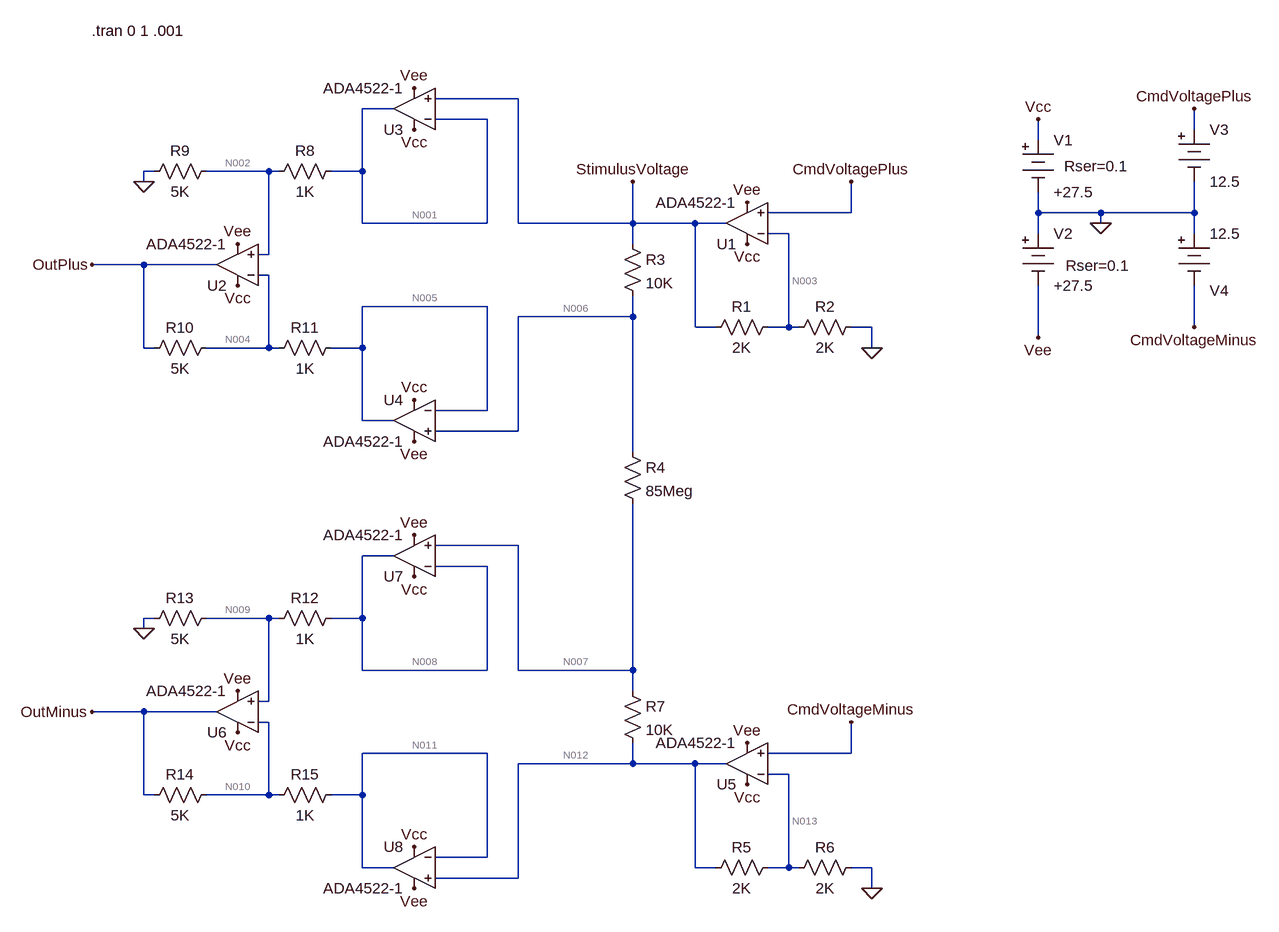
[diagram p0: schematic JukkaRev2_Model2D(012220).asc]
JukkaRev2_Model2D(012220).asc, the LTspice schematic file:
Version 4
SHEET 1 880 888
WIRE -560 -688 -688 -688
WIRE -752 -672 -800 -672
WIRE -608 -656 -688 -656
WIRE 480 -640 480 -672
WIRE 240 -624 240 -656
WIRE -1120 -576 -1136 -576
WIRE -944 -576 -1040 -576
WIRE -928 -576 -944 -576
WIRE -800 -576 -800 -672
WIRE -800 -576 -848 -576
WIRE -1136 -560 -1136 -576
WIRE -48 -512 -48 -560
WIRE -48 -512 -176 -512
WIRE 240 -512 240 -544
WIRE 336 -512 240 -512
WIRE 480 -512 480 -560
WIRE 480 -512 336 -512
WIRE -800 -496 -800 -576
WIRE -608 -496 -608 -656
WIRE -608 -496 -800 -496
WIRE -560 -496 -560 -688
WIRE -384 -496 -384 -560
WIRE -384 -496 -560 -496
WIRE -288 -496 -384 -496
WIRE -240 -496 -288 -496
WIRE 336 -496 336 -512
WIRE -144 -480 -176 -480
WIRE 240 -480 240 -512
WIRE 480 -480 480 -512
WIRE -384 -464 -384 -496
WIRE -944 -448 -944 -576
WIRE -944 -448 -960 -448
WIRE -1136 -432 -1216 -432
WIRE -1024 -432 -1136 -432
WIRE -944 -416 -960 -416
WIRE -608 -368 -800 -368
WIRE -384 -352 -384 -384
WIRE -384 -352 -560 -352
WIRE -288 -336 -288 -496
WIRE -256 -336 -288 -336
WIRE -144 -336 -144 -480
WIRE -144 -336 -176 -336
WIRE -128 -336 -144 -336
WIRE -16 -336 -48 -336
WIRE 480 -336 480 -400
WIRE 240 -320 240 -400
WIRE -1136 -304 -1136 -432
WIRE -1120 -304 -1136 -304
WIRE -944 -304 -944 -416
WIRE -944 -304 -1040 -304
WIRE -928 -304 -944 -304
WIRE -800 -304 -800 -368
WIRE -800 -304 -848 -304
WIRE -16 -304 -16 -336
WIRE -608 -208 -608 -368
WIRE -608 -208 -688 -208
WIRE -800 -192 -800 -304
WIRE -752 -192 -800 -192
WIRE -560 -176 -560 -352
WIRE -560 -176 -688 -176
WIRE -384 -144 -384 -352
WIRE -560 0 -688 0
WIRE -752 16 -800 16
WIRE -608 32 -688 32
WIRE -1120 112 -1136 112
WIRE -944 112 -1040 112
WIRE -928 112 -944 112
WIRE -800 112 -800 16
WIRE -800 112 -848 112
WIRE -1136 128 -1136 112
WIRE -800 192 -800 112
WIRE -608 192 -608 32
WIRE -608 192 -800 192
WIRE -560 192 -560 0
WIRE -384 192 -384 -64
WIRE -384 192 -560 192
WIRE -384 224 -384 192
WIRE -944 240 -944 112
WIRE -944 240 -960 240
WIRE -1136 256 -1216 256
WIRE -1024 256 -1136 256
WIRE -944 272 -960 272
WIRE -608 320 -800 320
WIRE -48 320 -48 272
WIRE -48 320 -176 320
WIRE -384 336 -384 304
WIRE -384 336 -560 336
WIRE -288 336 -384 336
WIRE -240 336 -288 336
WIRE -144 352 -176 352
WIRE -1136 384 -1136 256
WIRE -1120 384 -1136 384
WIRE -944 384 -944 272
WIRE -944 384 -1040 384
WIRE -928 384 -944 384
WIRE -800 384 -800 320
WIRE -800 384 -848 384
WIRE -608 480 -608 320
WIRE -608 480 -688 480
WIRE -800 496 -800 384
WIRE -752 496 -800 496
WIRE -288 496 -288 336
WIRE -256 496 -288 496
WIRE -144 496 -144 352
WIRE -144 496 -176 496
WIRE -128 496 -144 496
WIRE -16 496 -48 496
WIRE -560 512 -560 336
WIRE -560 512 -688 512
WIRE -16 528 -16 496
FLAG 336 -496 0
FLAG 240 -656 Vcc
FLAG 240 -320 Vee
FLAG -208 -464 Vcc
FLAG -16 -304 0
FLAG 480 -672 CmdVoltagePlus
FLAG 480 -336 CmdVoltageMinus
FLAG -48 -560 CmdVoltagePlus
FLAG -384 -560 StimulusVoltage
FLAG -720 -704 Vee
FLAG -720 -640 Vcc
FLAG -208 -528 Vee
FLAG -720 -160 Vee
FLAG -720 -224 Vcc
FLAG -992 -400 Vcc
FLAG -992 -464 Vee
FLAG -1216 -432 OutPlus
FLAG -1136 -560 0
FLAG -208 368 Vcc
FLAG -16 528 0
FLAG -48 272 CmdVoltageMinus
FLAG -720 -16 Vee
FLAG -720 48 Vcc
FLAG -208 304 Vee
FLAG -720 528 Vee
FLAG -720 464 Vcc
FLAG -992 288 Vcc
FLAG -992 224 Vee
FLAG -1216 256 OutMinus
FLAG -1136 128 0
SYMBOL Misc\\battery 240 -640 R0
WINDOW 123 0 0 Left 0
WINDOW 39 40 56 Left 2
SYMATTR SpiceLine Rser=0.1
SYMATTR InstName V1
SYMATTR Value +27.5
SYMBOL Misc\\battery 240 -496 R0
WINDOW 123 0 0 Left 0
WINDOW 39 42 65 Left 2
SYMATTR SpiceLine Rser=0.1
SYMATTR InstName V2
SYMATTR Value +27.5
SYMBOL res -160 -352 R90
WINDOW 0 0 56 VBottom 2
WINDOW 3 32 56 VTop 2
SYMATTR InstName R1
SYMATTR Value 2K
SYMBOL res -32 -352 R90
WINDOW 0 0 56 VBottom 2
WINDOW 3 32 56 VTop 2
SYMATTR InstName R2
SYMATTR Value 2K
SYMBOL Misc\\battery 480 -656 R0
WINDOW 123 0 0 Left 0
WINDOW 39 0 0 Left 0
SYMATTR InstName V3
SYMATTR Value 12.5
SYMBOL Misc\\battery 480 -496 R0
WINDOW 0 24 104 Left 2
WINDOW 3 24 16 Left 2
WINDOW 123 0 0 Left 0
WINDOW 39 0 0 Left 0
SYMATTR InstName V4
SYMATTR Value 12.5
SYMBOL res -400 -480 R0
SYMATTR InstName R3
SYMATTR Value 10K
SYMBOL res -400 -160 R0
SYMATTR InstName R4
SYMATTR Value 85Meg
SYMBOL res -832 -592 R90
WINDOW 0 0 56 VBottom 2
WINDOW 3 32 56 VTop 2
SYMATTR InstName R8
SYMATTR Value 1K
SYMBOL res -1024 -592 R90
WINDOW 0 0 56 VBottom 2
WINDOW 3 32 56 VTop 2
SYMATTR InstName R9
SYMATTR Value 5K
SYMBOL res -1024 -320 R90
WINDOW 0 0 56 VBottom 2
WINDOW 3 32 56 VTop 2
SYMATTR InstName R10
SYMATTR Value 5K
SYMBOL res -832 -320 R90
WINDOW 0 0 56 VBottom 2
WINDOW 3 32 56 VTop 2
SYMATTR InstName R11
SYMATTR Value 1K
SYMBOL Opamps\\ADA4522-1 -208 -432 R180
SYMATTR InstName U1
SYMBOL Opamps\\ADA4522-1 -992 -368 R180
SYMATTR InstName U2
SYMBOL Opamps\\ADA4522-1 -720 -608 R180
SYMATTR InstName U3
SYMBOL Opamps\\ADA4522-1 -720 -256 M0
SYMATTR InstName U4
SYMBOL res -160 480 R90
WINDOW 0 0 56 VBottom 2
WINDOW 3 32 56 VTop 2
SYMATTR InstName R5
SYMATTR Value 2K
SYMBOL res -32 480 R90
WINDOW 0 0 56 VBottom 2
WINDOW 3 32 56 VTop 2
SYMATTR InstName R6
SYMATTR Value 2K
SYMBOL res -400 208 R0
SYMATTR InstName R7
SYMATTR Value 10K
SYMBOL res -832 96 R90
WINDOW 0 0 56 VBottom 2
WINDOW 3 32 56 VTop 2
SYMATTR InstName R12
SYMATTR Value 1K
SYMBOL res -1024 96 R90
WINDOW 0 0 56 VBottom 2
WINDOW 3 32 56 VTop 2
SYMATTR InstName R13
SYMATTR Value 5K
SYMBOL res -1024 368 R90
WINDOW 0 0 56 VBottom 2
WINDOW 3 32 56 VTop 2
SYMATTR InstName R14
SYMATTR Value 5K
SYMBOL res -832 368 R90
WINDOW 0 0 56 VBottom 2
WINDOW 3 32 56 VTop 2
SYMATTR InstName R15
SYMATTR Value 1K
SYMBOL Opamps\\ADA4522-1 -208 400 R180
SYMATTR InstName U5
SYMBOL Opamps\\ADA4522-1 -992 320 R180
SYMATTR InstName U6
SYMBOL Opamps\\ADA4522-1 -720 80 R180
SYMATTR InstName U7
SYMBOL Opamps\\ADA4522-1 -720 432 M0
SYMATTR InstName U8
TEXT -1216 -792 Left 2 !.tran 0 1 .001

The netlist it stands for:
* JukkaRev2_Model2D(012220).asc
V1 Vcc 0 +27.5 Rser=0.1
V2 0 Vee +27.5 Rser=0.1
R1 N003 StimulusVoltage 2K
R2 0 N003 2K
V3 CmdVoltagePlus 0 12.5
V4 0 CmdVoltageMinus 12.5
R3 StimulusVoltage N006 10K
R4 N006 N007 85Meg
R8 N001 N002 1K
R9 N002 0 5K
R10 N004 OutPlus 5K
R11 N005 N004 1K
XU1 CmdVoltagePlus N003 Vcc Vee StimulusVoltage ADA4522-1  ; pins In+ In- V+ V- OUT
XU2 N002 N004 Vcc Vee OutPlus ADA4522-1  ; pins In+ In- V+ V- OUT
XU3 StimulusVoltage N001 Vcc Vee N001 ADA4522-1  ; pins In+ In- V+ V- OUT
XU4 N006 N005 Vcc Vee N005 ADA4522-1  ; pins In+ In- V+ V- OUT
R5 N013 N012 2K
R6 0 N013 2K
R7 N007 N012 10K
R12 N008 N009 1K
R13 N009 0 5K
R14 N010 OutMinus 5K
R15 N011 N010 1K
XU5 CmdVoltageMinus N013 Vcc Vee N012 ADA4522-1  ; pins In+ In- V+ V- OUT
XU6 N009 N010 Vcc Vee OutMinus ADA4522-1  ; pins In+ In- V+ V- OUT
XU7 N007 N008 Vcc Vee N008 ADA4522-1  ; pins In+ In- V+ V- OUT
XU8 N012 N011 Vcc Vee N011 ADA4522-1  ; pins In+ In- V+ V- OUT
.tran 0 1 .001
.backanno
.end

* Results of the author's LTspice run, read from the files saved beside the schematic
* Operating Point, zero values left out:
*   V(vcc) = 27.5 V
*   V(vee) = -27.5 V
*   V(n003) = 12.5 V
*   V(stimulusvoltage) = 25 V
*   V(cmdvoltageplus) = 12.5 V
*   V(cmdvoltageminus) = -12.5 V
*   V(n006) = 24.99 V
*   V(n007) = -24.99 V
*   V(n001) = 25 V
*   V(n002) = 20.83 V
*   V(n004) = 20.83 V
*   V(outplus) = 29.18 mV
*   V(n005) = 24.99 V
*   V(n013) = -12.5 V
*   V(n012) = -25 V
*   V(n008) = -24.99 V
*   V(n009) = -20.83 V
*   V(n010) = -20.83 V
*   V(outminus) = 29.86 mV
*   V(n011) = -25 V
*   I(R15) = -4.172 mA
*   I(R14) = -4.172 mA
*   I(R13) = -4.166 mA
*   I(R12) = -4.166 mA
*   I(R7) = 590.5 nA
*   I(R6) = 6.25 mA
*   I(R5) = 6.25 mA
*   I(R11) = 4.161 mA
*   I(R10) = 4.161 mA
*   I(R9) = 4.167 mA
*   I(R8) = 4.167 mA
*   I(R4) = 588.1 nA
*   I(R3) = 590.4 nA
*   I(R2) = -6.25 mA
*   I(R1) = -6.25 mA
*   I(V4) = -1.336 nA
*   I(V3) = -1.178 nA
*   I(V2) = -20.45 mA
*   I(V1) = -20.45 mA